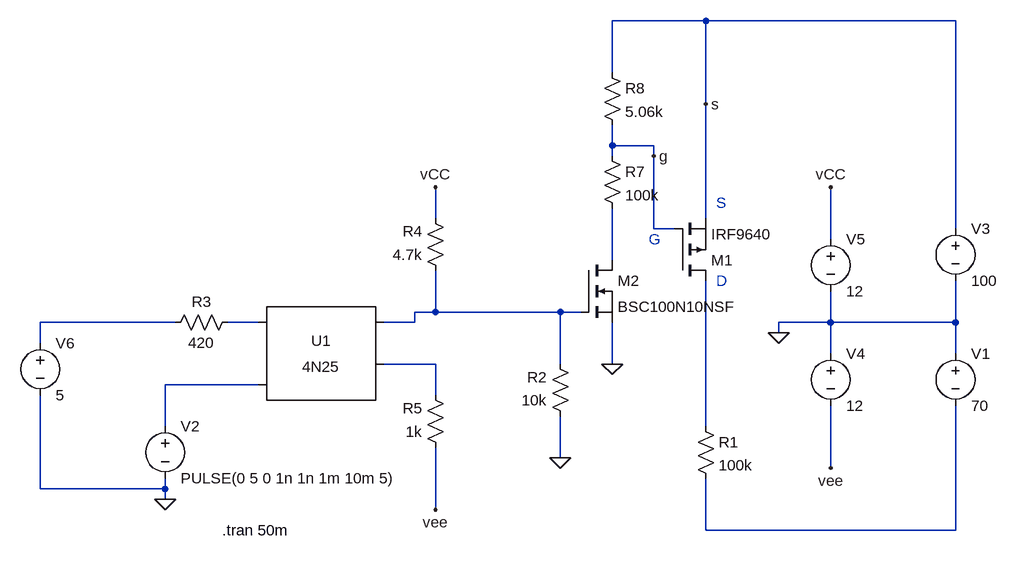
[diagram p0: schematic readPlateDriver.asc]
readPlateDriver.asc, the LTspice schematic file:
Version 4
SHEET 1 1400 692
WIRE 752 -208 608 -208
WIRE 1136 -208 752 -208
WIRE 608 -128 608 -208
WIRE 752 -80 752 -208
WIRE 608 -16 608 -48
WIRE 672 -16 608 -16
WIRE 608 0 608 -16
WIRE 672 0 672 -16
WIRE 336 96 336 48
WIRE 752 96 752 -80
WIRE 672 112 672 0
WIRE 704 112 672 112
WIRE 1136 112 1136 -208
WIRE 944 128 944 48
WIRE 608 160 608 80
WIRE 336 240 336 176
WIRE 336 240 304 240
WIRE 528 240 336 240
WIRE 560 240 528 240
WIRE -64 256 -272 256
WIRE 64 256 16 256
WIRE 304 256 304 240
WIRE 304 256 256 256
WIRE 944 256 944 208
WIRE 944 256 864 256
WIRE 1136 256 1136 192
WIRE 1136 256 944 256
WIRE 864 272 864 256
WIRE -272 288 -272 256
WIRE 944 304 944 256
WIRE 1136 304 1136 256
WIRE 336 320 256 320
WIRE 528 320 528 240
WIRE 608 320 608 256
WIRE 64 352 -80 352
WIRE 336 368 336 320
WIRE -80 416 -80 352
WIRE 752 416 752 192
WIRE 528 464 528 400
WIRE 944 480 944 384
WIRE -272 512 -272 368
WIRE -80 512 -80 496
WIRE -80 512 -272 512
WIRE -80 528 -80 512
WIRE 336 544 336 448
WIRE 752 576 752 496
WIRE 1136 576 1136 384
WIRE 1136 576 752 576
FLAG -80 528 0
FLAG 864 272 0
FLAG 944 480 vee
FLAG 944 48 vCC
FLAG 608 320 0
FLAG 672 0 g
FLAG 752 -80 s
FLAG 336 48 vCC
FLAG 336 544 vee
FLAG 528 464 0
SYMBOL voltage 1136 288 R0
SYMATTR InstName V1
SYMATTR Value 70
SYMATTR SpiceLine Rser=5
SYMBOL voltage -80 400 R0
SYMATTR InstName V2
SYMATTR Value PULSE(0 5 0 1n 1n 1m 10m 5)
SYMBOL voltage 944 288 R0
SYMATTR InstName V4
SYMATTR Value 12
SYMBOL voltage 944 112 R0
SYMATTR InstName V5
SYMATTR Value 12
SYMATTR SpiceLine Rser=5
SYMBOL res 736 400 R0
SYMATTR InstName R1
SYMATTR Value 100k
SYMBOL pmos 704 192 M180
SYMATTR InstName M1
SYMATTR Value IRF9640
SYMBOL voltage 1136 96 R0
SYMATTR InstName V3
SYMATTR Value 100
SYMATTR SpiceLine Rser=5
SYMBOL nmos 560 160 R0
SYMATTR InstName M2
SYMATTR Value BSC100N10NSF
SYMBOL res 592 -16 R0
SYMATTR InstName R7
SYMATTR Value 100k
SYMBOL res 544 416 R180
WINDOW 0 36 76 Left 2
WINDOW 3 36 40 Left 2
SYMATTR InstName R2
SYMATTR Value 10k
SYMBOL res 592 -144 R0
SYMATTR InstName R8
SYMATTR Value 5.06k
SYMBOL 4N25 160 320 R0
SYMATTR InstName U1
SYMBOL res 32 240 R90
WINDOW 0 0 56 VBottom 2
WINDOW 3 32 56 VTop 2
SYMATTR InstName R3
SYMATTR Value 420
SYMBOL res 352 192 R180
WINDOW 0 36 76 Left 2
WINDOW 3 36 40 Left 2
SYMATTR InstName R4
SYMATTR Value 4.7k
SYMBOL res 352 464 R180
WINDOW 0 36 76 Left 2
WINDOW 3 36 40 Left 2
SYMATTR InstName R5
SYMATTR Value 1k
SYMBOL voltage -272 272 R0
SYMATTR InstName V6
SYMATTR Value 5
SYMATTR SpiceLine Rser=0
TEXT 8 576 Left 2 !.tran 50m
TEXT 768 72 Left 2 ;S
TEXT 768 192 Left 2 ;D
TEXT 664 128 Left 2 ;G

The netlist it stands for:
* readPlateDriver.asc
V1 0 N008 70 Rser=5
V2 N006 0 PULSE(0 5 0 1n 1n 1m 10m 5)
V4 0 vee 12
V5 vCC 0 12 Rser=5
R1 N007 N008 100k
M1 N007 g s s IRF9640
V3 s 0 100 Rser=5
M2 N001 N002 0 0 BSC100N10NSF
R7 g N001 100k
R2 0 N002 10k
R8 s g 5.06k
XU1 N004 N006 N002 N005 NC_01 4N25
R3 N004 N003 420
R4 N002 vCC 4.7k
R5 vee N005 1k
V6 N003 0 5 Rser=0
.model NMOS NMOS
.model PMOS PMOS
.lib standard.mos
.tran 50m
* S
* D
* G
.lib 4N25.sub
.backanno
.end